# EasyEDA schematic SCH_HVACPCBProject_2026-05-03.json
TITLE: Sheet_1; REV: 1.0; Date: 2025-07-31; Sheet: 1/1; Drawn By: rahber; Company: Your Company
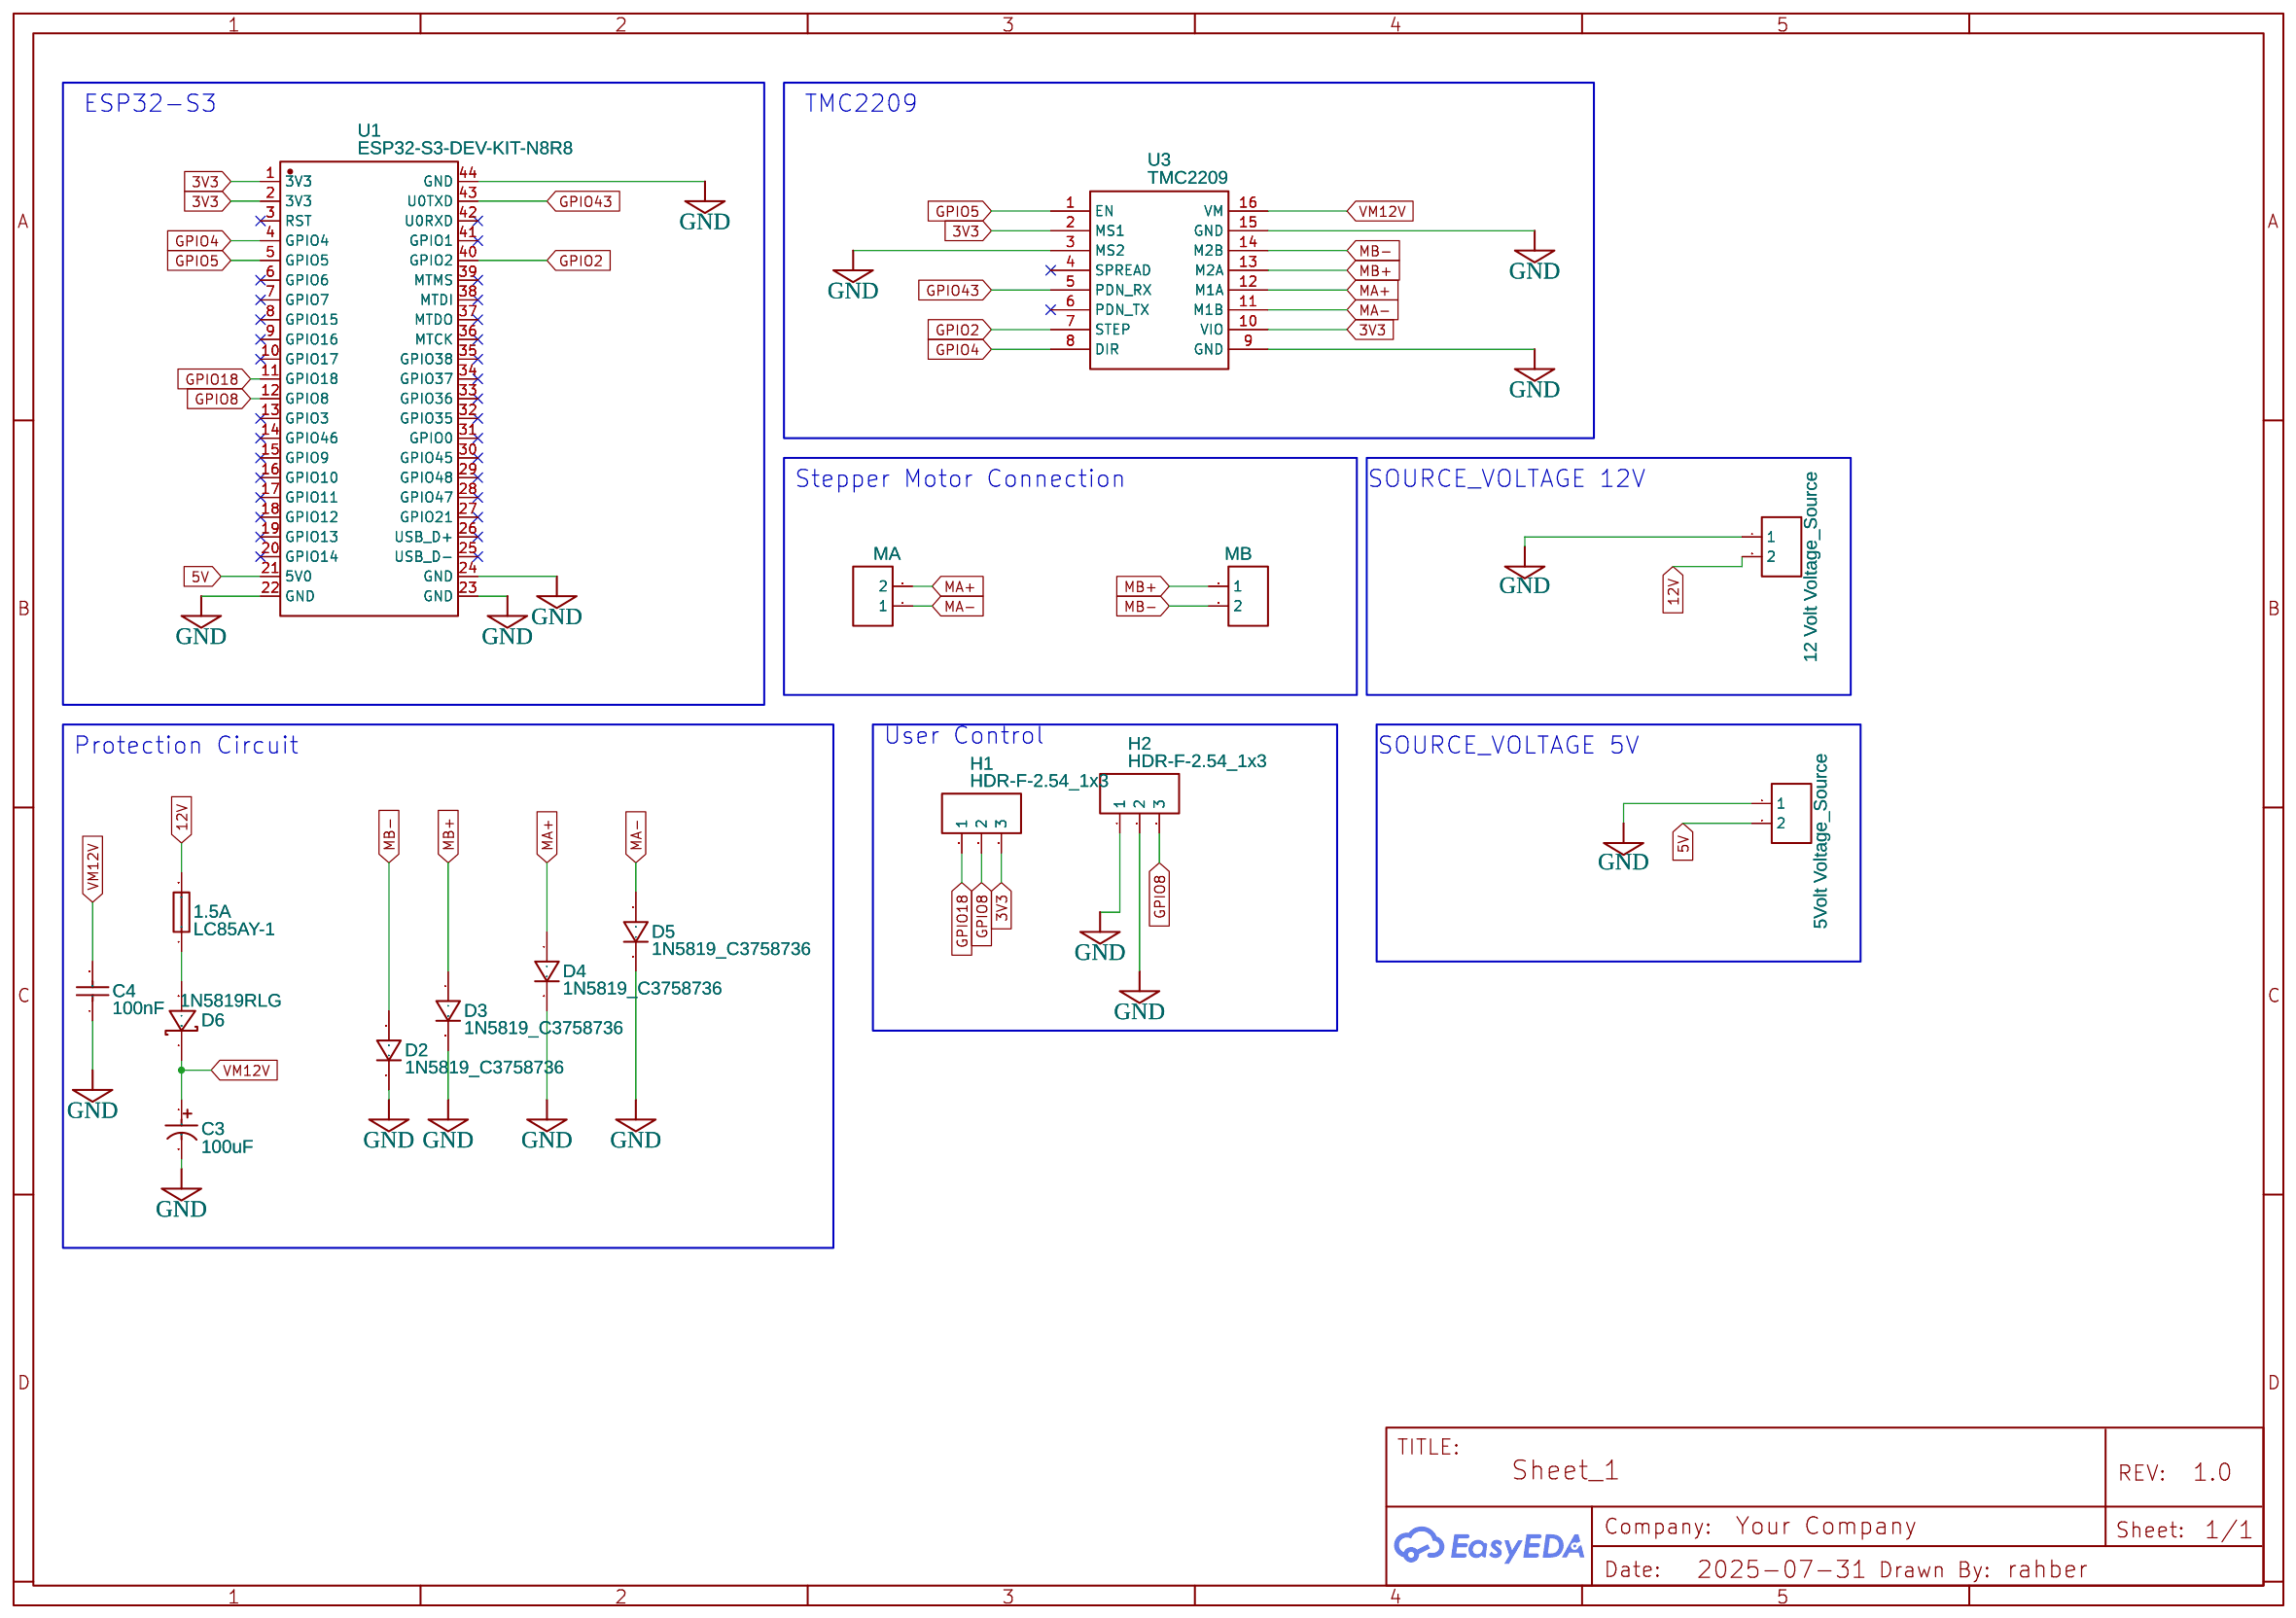
[diagram p0: schematic sheet]

## Parts
1.5A  LC85AY-1  [FUSE-SMD-L4.0-W1.8]
C3  100uF  [CAP-TH_BD10.0-P5.00-D1.0-FD]
C4  100nF  [CAP-TH_L5.0-W4.0-P5.00-D1.0]
D2  1N5819_C3758736  [DO-41_BD2.4-L4.7-P8.70-D0.8-FD]
D3  1N5819_C3758736  [DO-41_BD2.4-L4.7-P8.70-D0.8-FD]
D4  1N5819_C3758736  [DO-41_BD2.4-L4.7-P8.70-D0.8-FD]
D5  1N5819_C3758736  [DO-41_BD2.4-L4.7-P8.70-D0.8-FD]
D6  1N5819RLG  [DO-41_BD2.4-L4.7-P8.70-D0.9-RD]
H1  HDR-F-2.54_1x3  [HDR-F-2.54_1X3]
H2  HDR-F-2.54_1x3  [HDR-F-2.54_1X3]
P1  MB  [CONN-TH_2P-P5.08]
P2  MA  [CONN-TH_2P-P5.08]
P3  12 Volt Voltage_Source  [CONN-TH_2P-P5.08]
P5  5Volt Voltage_Source  [CONN-TH_2P-P5.08]
U1  ESP32-S3-DEV-KIT-N8R8  [COMM-TH_L63.3-W25.4-P2.54-LS22.86]
U3  TMC2209  [TMC2209]

## Library data of the parts
1.5A = LC85AY-1: Supplier: LCSC; Supplier Part: C17520452; Manufacturer: BOURNS; Contributor: lcsc; JLCPCB Part Class: Extended Part
C3 = Non - polar electrolytic capacitors10uf 100v: Supplier: LCSC; Manufacturer: CX(承兴); Manufacturer Part: NP106V100G12RR0VH2FP0; Supplier Part: C56706; JLCPCB Part Class: Extended Part
C4 = Ceramic capacitors47PF 3KV: Supplier: LCSC; Manufacturer: null; Manufacturer Part: 瓷片电容47PF 3KV; Supplier Part: C19375; JLCPCB Part Class: Extended Part
D2-D5 = 1N5819_C3758736: Contributor: lcsc; Supplier: LCSC; Supplier Part: C3758736; Manufacturer: Taiwan Semiconductor(台湾半导体); Manufacturer Part: 1N5819; JLCPCB Part Class: Extended Part
D6 = 1N5819RLG: Contributor: LCSC; Supplier: LCSC; Supplier Part: C88393; Manufacturer: onsemi(安森美); JLCPCB Part Class: Extended Part
H1 H2 = HDR-F-2.54_1x3: Supplier Part: C146690; Supplier: LCSC; Contributor: LCEDA_Lib
P1-P3 P5 = CONN-TH_2P-P5.08: Supplier: LCSC; Contributor: LCEDA_Lib
U1 = ESP32-S3-DEV-KIT-N8R8: Supplier: LCSC; Supplier Part: C9900170771; Manufacturer: null; Contributor: lcsc
U3 = TMC2209: Contributor: yoduc

## Nets
3V3: H1.3 U1.1(3V3) U1.2(3V3) U3.2(MS1) U3.10(VIO)
5V: P5.2 U1.21(5V0)
12V: 1.5A.2 P3.2
GND: C3.2 C4.1 D2.2(K) D3.2(K) D4.2(K) D5.2(K) H2.1 H2.2 P3.1 P5.1 U1.22(GND) U1.23(GND) U1.24(GND) U1.44(GND) U3.3(MS2) U3.9(GND) U3.15(GND)
GPIO2: U1.40(GPIO2) U3.7(STEP)
GPIO4: U1.4(GPIO4) U3.8(DIR)
GPIO5: U1.5(GPIO5) U3.1(EN)
GPIO8: H1.2 H2.3 U1.12(GPIO8)
GPIO18: H1.1 U1.11(GPIO18)
GPIO43: U1.43(U0TXD) U3.5(PDN RX)
MA+: D4.1(A) P2.2 U3.12(M1A)
MA-: D5.1(A) P2.1 U3.11(M1B)
MB+: D3.1(A) P1.1 U3.13(M2A)
MB-: D2.1(A) P1.2 U3.14(M2B)
VM12V: C3.1 C4.2 D6.1(C) U3.16(VM)
Net-(1.5A-1): 1.5A.1 D6.2(A)

Not connected (* = marked no-connect by the designer): U1 3(RST)* 6(GPIO6)* 7(GPIO7)* 8(GPIO15)* 9(GPIO16)* 10(GPIO17)* 13(GPIO3)* 14(GPIO46)* 15(GPIO9)* 16(GPIO10)* 17(GPIO11)* 18(GPIO12)* 19(GPIO13)* 20(GPIO14)* 25(USB_D-)* 26(USB_D+)* 27(GPIO21)* 28(GPIO47)* 29(GPIO48)* 30(GPIO45)* 31(GPIO0)* 32(GPIO35)* 33(GPIO36)* 34(GPIO37)* 35(GPIO38)* 36(MTCK)* 37(MTDO)* 38(MTDI)* 39(MTMS)* 41(GPIO1)* 42(U0RXD)*; U3 4(SPREAD)* 6(PDN TX)*

## Notes on the sheet
- ESP32-S3
- TMC2209
- Stepper Motor Connection
- SOURCE_VOLTAGE 12V
- Protection Circuit
- User Control
- SOURCE_VOLTAGE 5V
